# Altium schematic sheet S12_Clocks.SchDoc
size 381 x 241 mm; SheetNumber: 12; SheetTotal: 12
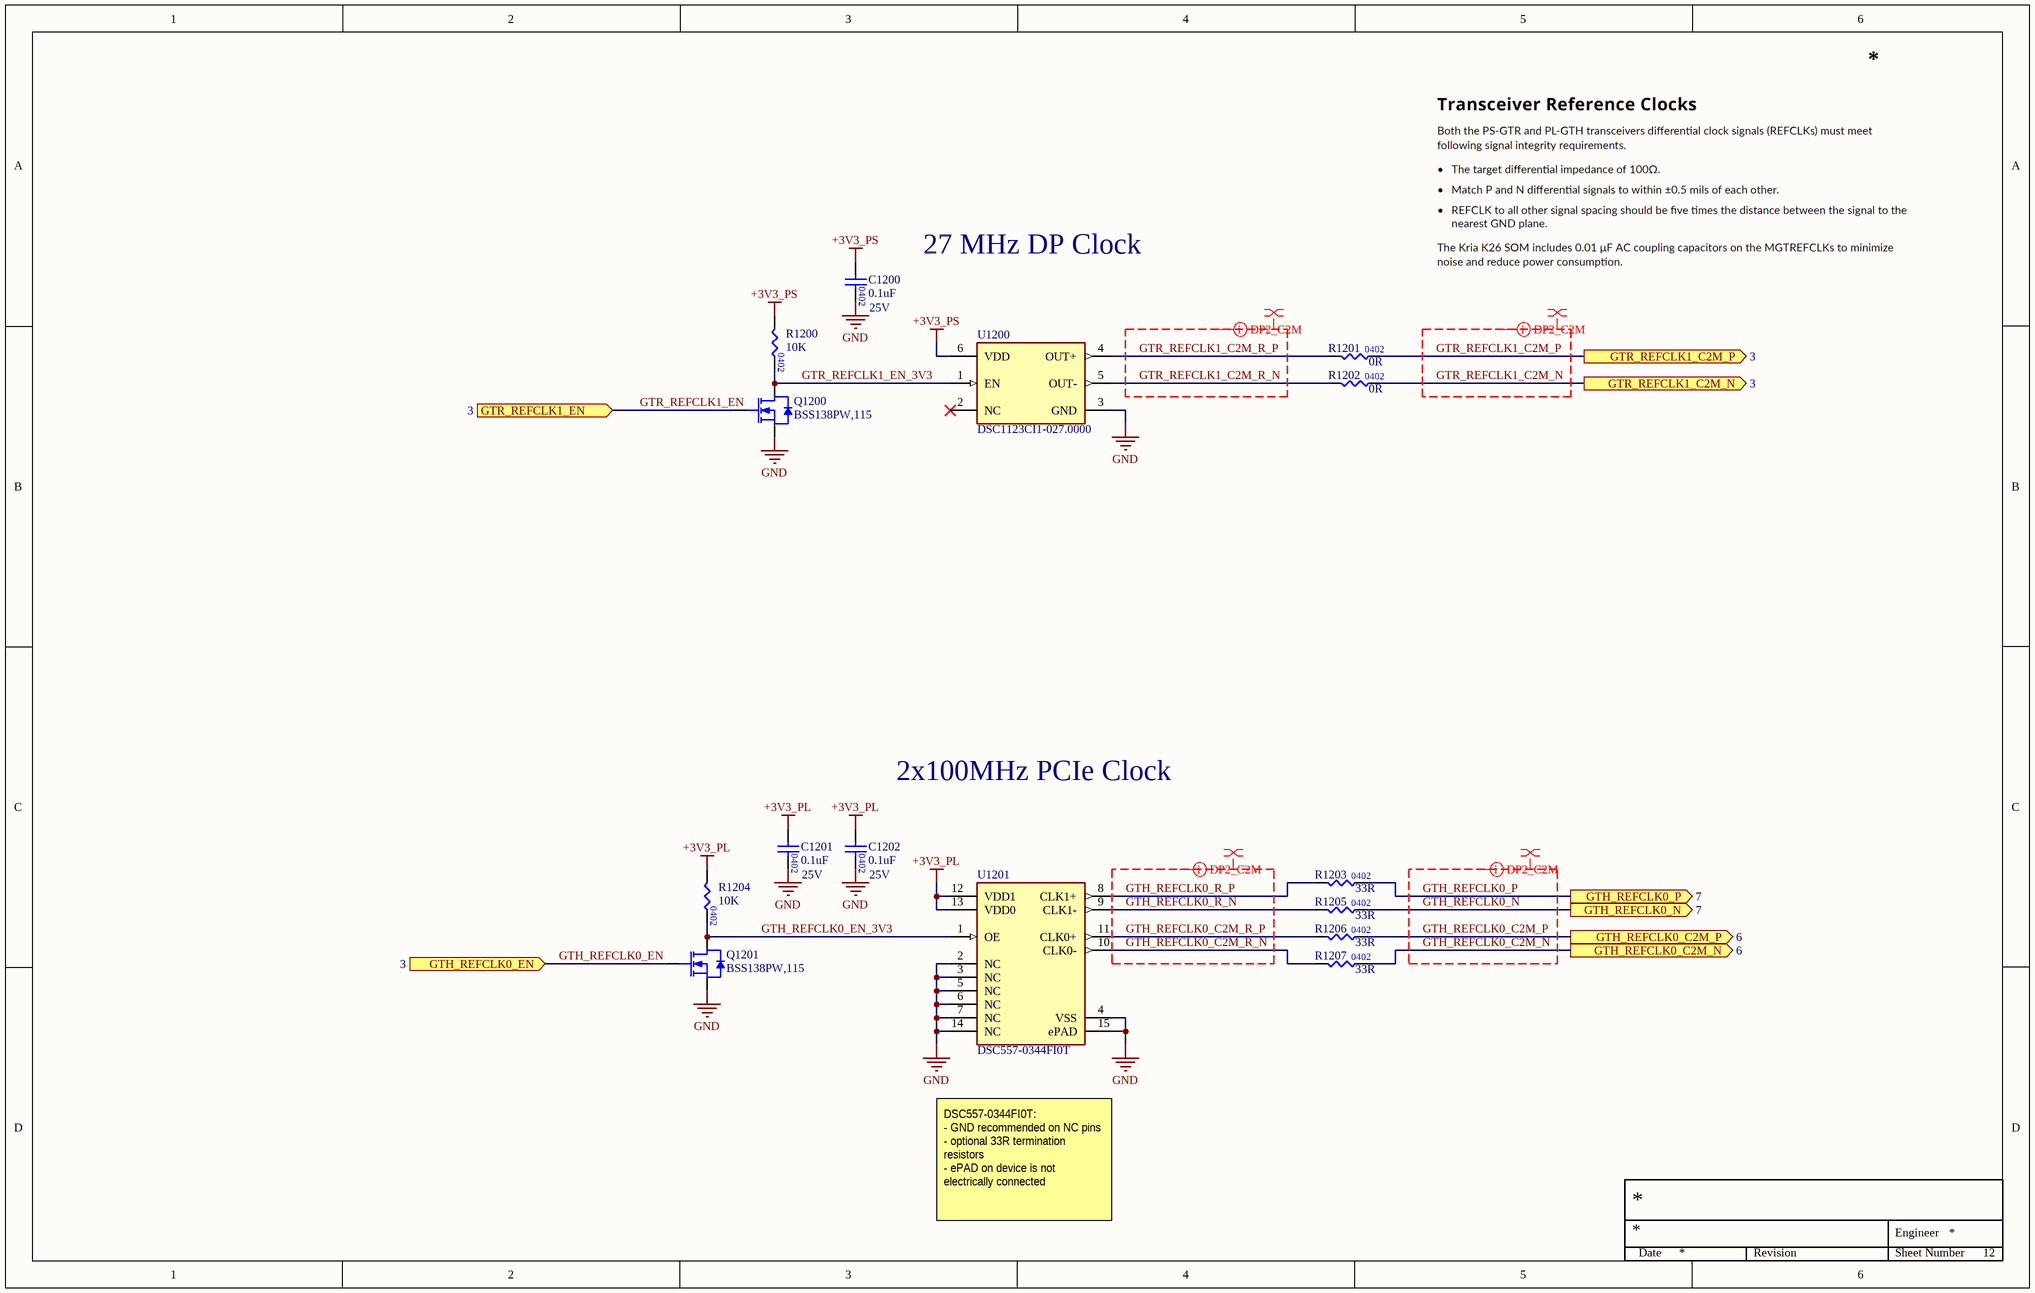
[diagram p0: S12_Clocks.SchDoc]

## Parts
C1200  value 0.1uF  Voltage Rating: 25V  [CAP0402]  (hidden comment: CAP_0402)
C1201  value 0.1uF  Voltage Rating: 25V  [CAP0402]  (hidden comment: CAP_0402)
C1202  value 0.1uF  Voltage Rating: 25V  [CAP0402]  (hidden comment: CAP_0402)
Q1200  BSS138PW,115  [NEXPERIA_SOT323]
Q1201  BSS138PW,115  [NEXPERIA_SOT323]
R1200  Resistance: 10K  [RES0402]  (hidden comment: RES_0402)
R1201  Resistance: 0R  [RES0402]  (hidden comment: RES_0402)
R1202  Resistance: 0R  [RES0402]  (hidden comment: RES_0402)
R1203  Resistance: 33R  [RES0402]  (hidden comment: RES_0402)
R1204  Resistance: 10K  [RES0402]  (hidden comment: RES_0402)
R1205  Resistance: 33R  [RES0402]  (hidden comment: RES_0402)
R1206  Resistance: 33R  [RES0402]  (hidden comment: RES_0402)
R1207  Resistance: 33R  [RES0402]  (hidden comment: RES_0402)
U1200  DSC1123CI1-027.0000  [MICROCHIP_VDFN-6_H5A]
U1201  DSC557-0344FI0T  [MICROCHIP_QFN2532-14]

## Ports
GTH_REFCLK0_C2M_N (out, see 6), GTH_REFCLK0_C2M_P (out, see 6), GTH_REFCLK0_EN (in, see 3), GTH_REFCLK0_N (out, see 7), GTH_REFCLK0_P (out, see 7), GTR_REFCLK1_C2M_N (out, see 3), GTR_REFCLK1_C2M_P (out, see 3), GTR_REFCLK1_EN (in, see 3)

## Nets
+3V3_PL: C1201.1 C1202.1 R1204.1 U1201.12(VDD1) U1201.13(VDD0)
+3V3_PS: C1200.1 R1200.1 U1200.6(VDD)
GND: C1200.2 C1201.2 C1202.2 Q1200.2(Source) Q1201.2(Source) U1200.3(GND) U1201.2(NC) U1201.3(NC) U1201.4(VSS) U1201.5(NC) U1201.6(NC) U1201.7(NC) U1201.14(NC) U1201.15(ePAD)
GTH_REFCLK0_C2M_N: R1207.2 ; port GTH_REFCLK0_C2M_N
GTH_REFCLK0_C2M_P: R1206.2 ; port GTH_REFCLK0_C2M_P
GTH_REFCLK0_C2M_R_N: R1207.1 U1201.10(CLK0-)
GTH_REFCLK0_C2M_R_P: R1206.1 U1201.11(CLK0+)
GTH_REFCLK0_EN: Q1201.1(Gate) ; port GTH_REFCLK0_EN
GTH_REFCLK0_EN_3V3: Q1201.3(Drain) R1204.2 U1201.1(OE)
GTH_REFCLK0_N: R1205.2 ; port GTH_REFCLK0_N
GTH_REFCLK0_P: R1203.2 ; port GTH_REFCLK0_P
GTH_REFCLK0_R_N: R1205.1 U1201.9(CLK1-)
GTH_REFCLK0_R_P: R1203.1 U1201.8(CLK1+)
GTR_REFCLK1_C2M_N: R1202.2 ; port GTR_REFCLK1_C2M_N
GTR_REFCLK1_C2M_P: R1201.2 ; port GTR_REFCLK1_C2M_P
GTR_REFCLK1_C2M_R_N: R1202.1 U1200.5(OUT-)
GTR_REFCLK1_C2M_R_P: R1201.1 U1200.4(OUT+)
GTR_REFCLK1_EN: Q1200.1(Gate) ; port GTR_REFCLK1_EN
GTR_REFCLK1_EN_3V3: Q1200.3(Drain) R1200.2 U1200.1(EN)

Not connected (* = marked no-connect by the designer): U1200 2(NC)*

## Layout directives
differential pair; differential pair class DIFFPAIR100: GTH_REFCLK0_C2M_N, GTH_REFCLK0_C2M_P, GTH_REFCLK0_C2M_R_N, GTH_REFCLK0_C2M_R_P, GTH_REFCLK0_N, GTH_REFCLK0_P, GTH_REFCLK0_R_N, GTH_REFCLK0_R_P, GTR_REFCLK1_C2M_N, GTR_REFCLK1_C2M_P, GTR_REFCLK1_C2M_R_N, GTR_REFCLK1_C2M_R_P
net class DIFFPAIR_REFCLK: GTH_REFCLK0_C2M_N, GTH_REFCLK0_C2M_P, GTH_REFCLK0_C2M_R_N, GTH_REFCLK0_C2M_R_P, GTH_REFCLK0_N, GTH_REFCLK0_P, GTH_REFCLK0_R_N, GTH_REFCLK0_R_P, GTR_REFCLK1_C2M_N, GTR_REFCLK1_C2M_P, GTR_REFCLK1_C2M_R_N, GTR_REFCLK1_C2M_R_P

## Notes on the sheet
- 27 MHz DP Clock
- 2x100MHz PCIe Clock
- DSC557-0344FI0T:
  - GND recommended on NC pins
  - optional 33R termination resistors
  - ePAD on device is not electrically connected
- Engineer
- Date
- Revision
- Sheet Number

## Library data of the parts
C1200-C1202 = CAP_CL05A104KA5NNNC: CAP CER 0.1UF 25V X5R 0402; Manufacturer: Samsung Electro-Mechanics; Tolerance: 10%; Manufacturer Part Number 1: CL05A104KA5NNNC; Case/Package: 0402; Mounting Type: Surface Mount; Temperature Coefficient: X5R
Q1200 Q1201 = BSS138PW,115: MOSFET N-CH 60V 320MA SOT323
R1200 R1204 = .RES_RC0402FR-0710KL: RES 10K OHM 1% 1/16W 0402; Manufacturer: YAGEO; Manufacturer Part Number: RC0402FR-0710KL; Case/Package: 0402; Tolerance: 1%
R1201 R1202 = .RES_RC0402JR-070RL: RES 0 OHM JUMPER 1/16W 0402; Manufacturer: YAGEO; Tolerance: 1%; Manufacturer Part Number: RC0402JR-070RL; Case/Package: 0402
R1203 R1205-R1207 = .RES_RC0402FR-0733RL: RES 33 OHM 1% 1/16W 0402; Manufacturer: YAGEO; Manufacturer Part Number: RC0402FR-0733RL; Case/Package: 0402; Tolerance: 1%
U1200 = DSC1123CI1-027.0000: MEMS OSC XO 27.0000MHZ LVDS SMD
U1201 = DSC557-0344FI0T: IC CLOCK GEN PCIE 14QFN